# EAGLE design untitled (EAGLE 8.2.2)
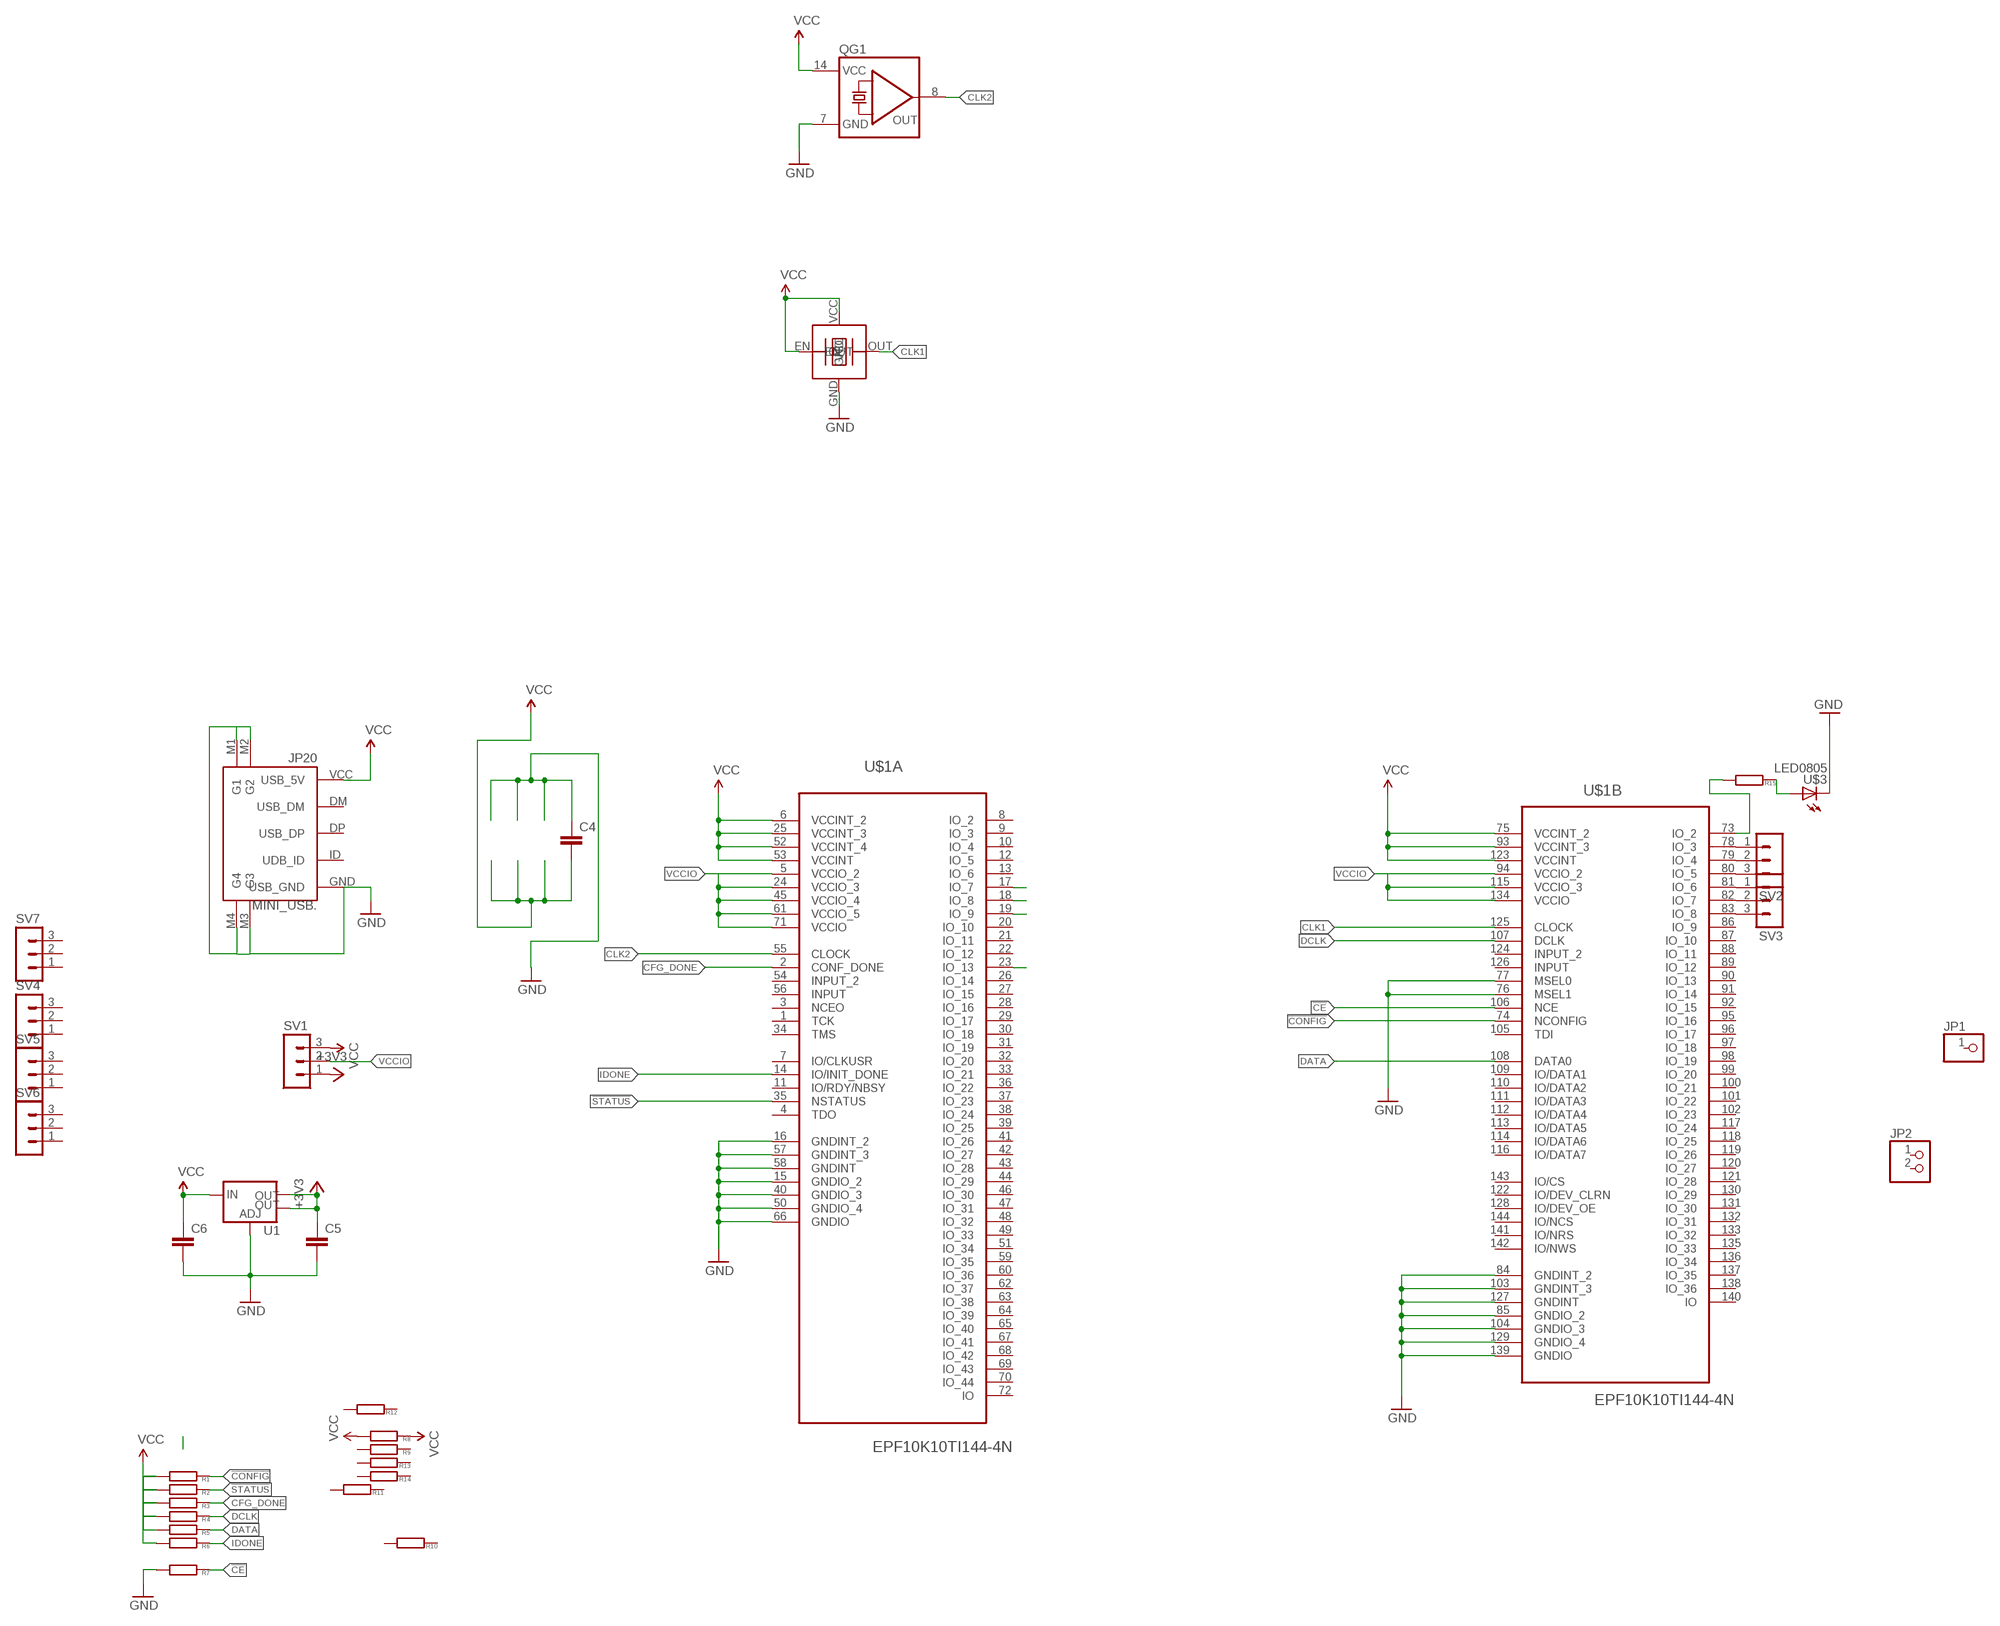
[diagram p0: schematic, sheet 1]

## Parts
C4  CC0805  [C0805]
C5  CC0805  [C0805]
C6  CC0805  [C0805]
JP1  PINHD-1X1  [1X01]
JP2  PINHD-1X2  [1X02]
JP20  MINI_USB.  [32005-201]
QG1  QG5860  [DIL14S]
R1  R0603  [0603]
R2  R0603  [0603]
R3  R0603  [0603]
R4  R0603  [0603]
R5  R0603  [0603]
R6  R0603  [0603]
R7  R0603  [0603]
R8  R0603  [0603]
R9  R0603  [0603]
R10  R0603  [0603]
R11  R0603  [0603]
R12  R0603  [0603]
R13  R0603  [0603]
R14  R0603  [0603]
R15  R0603  [0603]
SV1  MA03-1  [MA03-1]
SV2  MA03-1  [MA03-1]
SV3  MA03-1  [MA03-1]
SV4  MA03-1  [MA03-1]
SV5  MA03-1  [MA03-1]
SV6  MA03-1  [MA03-1]
SV7  MA03-1  [MA03-1]
U1  V_REG_LM1117SOT223  [SOT223]
U$1  EPF10K10TI144-4N  [QFP50P2200X2200X160-144N]
U$2  TXC-BA  [7X5]
U$3  LED0805  [0805-LED]

## Nets
!CE: R7.1 U$1.106(B:NCE)
!CONFIG: R1.1 U$1.74(B:NCONFIG)
!STATUS: R2.1 U$1.35(A:NSTATUS)
+3V3: C5.1 SV1.1 U1.2(OUT) U1.4(OUT)
CFG_DONE: R3.1 U$1.2(A:CONF_DONE)
CLK1: U$1.125(B:CLOCK) U$2.OUT
CLK2: QG1.8(OUT) U$1.55(A:CLOCK)
DATA: R5.1 U$1.108(B:DATA0)
DCLK: R4.1 U$1.107(B:DCLK)
GND: C4.1 C5.2 C6.2 JP20.GND(USB_GND) JP20.M1(G1) JP20.M2(G2) JP20.M3(G3) JP20.M4(G4) QG1.7(GND) R7.2 U1.1(ADJ) U$1.15(A:GNDIO_2) U$1.16(A:GNDINT_2) U$1.40(A:GNDIO_3) U$1.50(A:GNDIO_4) U$1.57(A:GNDINT_3) U$1.58(A:GNDINT) U$1.66(A:GNDIO) U$1.76(B:MSEL1) U$1.77(B:MSEL0) U$1.84(B:GNDINT_2) U$1.85(B:GNDIO_2) U$1.103(B:GNDINT_3) U$1.104(B:GNDIO_3) U$1.127(B:GNDINT) U$1.129(B:GNDIO_4) U$1.139(B:GNDIO) U$2.GND U$3.C
IDONE: R6.1 U$1.14(A:IO/INIT_DONE)
N$1: R11.1
N$3: U$1.17(A:IO_7)
N$4: R11.2
N$7: SV2.1 U$1.78(B:IO_3)
N$8: SV2.2 U$1.79(B:IO_4)
N$9: SV2.3 U$1.80(B:IO_5)
N$10: SV3.1 U$1.81(B:IO_6)
N$11: SV3.2 U$1.82(B:IO_7)
N$12: SV3.3 U$1.83(B:IO_8)
N$13: R15.2 U$1.73(B:IO_2)
N$14: R15.1 U$3.A
N$23: U$1.18(A:IO_8)
N$24: U$1.19(A:IO_9)
N$28: U$1.23(A:IO_13)
VCC: C4.2 C6.1 JP20.VCC(USB_5V) QG1.14(VCC) R1.2 R2.2 R3.2 R4.2 R5.2 R6.2 R8.1 R8.2 SV1.3 U1.3(IN) U$1.6(A:VCCINT_2) U$1.25(A:VCCINT_3) U$1.52(A:VCCINT_4) U$1.53(A:VCCINT) U$1.75(B:VCCINT_2) U$1.93(B:VCCINT_3) U$1.123(B:VCCINT) U$2.EN U$2.VCC
VCCIO: SV1.2 U$1.5(A:VCCIO_2) U$1.24(A:VCCIO_3) U$1.45(A:VCCIO_4) U$1.61(A:VCCIO_5) U$1.71(A:VCCIO) U$1.94(B:VCCIO_2) U$1.115(B:VCCIO_3) U$1.134(B:VCCIO)
Unconnected: JP1.1 JP2.1 JP2.2 JP20.DM(USB_DM) JP20.DP(USB_DP) JP20.ID(UDB_ID) R9.1 R9.2 R10.1 R10.2 R12.1 R12.2 R13.1 R13.2 R14.1 R14.2 SV4.1 SV4.2 SV4.3 SV5.1 SV5.2 SV5.3 SV6.1 SV6.2 SV6.3 SV7.1 SV7.2 SV7.3 U$1.1(A:TCK) U$1.3(A:NCEO) U$1.4(A:TDO) U$1.7(A:IO/CLKUSR) U$1.8(A:IO_2) U$1.9(A:IO_3) U$1.10(A:IO_4) U$1.11(A:IO/RDY/NBSY) U$1.12(A:IO_5) U$1.13(A:IO_6) U$1.20(A:IO_10) U$1.21(A:IO_11) U$1.22(A:IO_12) U$1.26(A:IO_14) U$1.27(A:IO_15) U$1.28(A:IO_16) U$1.29(A:IO_17) U$1.30(A:IO_18) U$1.31(A:IO_19) U$1.32(A:IO_20) U$1.33(A:IO_21) U$1.34(A:TMS) U$1.36(A:IO_22) U$1.37(A:IO_23) U$1.38(A:IO_24) U$1.39(A:IO_25) U$1.41(A:IO_26) U$1.42(A:IO_27) U$1.43(A:IO_28) U$1.44(A:IO_29) U$1.46(A:IO_30) U$1.47(A:IO_31) U$1.48(A:IO_32) U$1.49(A:IO_33) U$1.51(A:IO_34) U$1.54(A:INPUT_2) U$1.56(A:INPUT) U$1.59(A:IO_35) U$1.60(A:IO_36) U$1.62(A:IO_37) U$1.63(A:IO_38) U$1.64(A:IO_39) U$1.65(A:IO_40) U$1.67(A:IO_41) U$1.68(A:IO_42) U$1.69(A:IO_43) U$1.70(A:IO_44) U$1.72(A:IO) U$1.86(B:IO_9) U$1.87(B:IO_10) U$1.88(B:IO_11) U$1.89(B:IO_12) U$1.90(B:IO_13) U$1.91(B:IO_14) U$1.92(B:IO_15) U$1.95(B:IO_16) U$1.96(B:IO_17) U$1.97(B:IO_18) U$1.98(B:IO_19) U$1.99(B:IO_20) U$1.100(B:IO_21) U$1.101(B:IO_22) U$1.102(B:IO_23) U$1.105(B:TDI) U$1.109(B:IO/DATA1) U$1.110(B:IO/DATA2) U$1.111(B:IO/DATA3) U$1.112(B:IO/DATA4) U$1.113(B:IO/DATA5) U$1.114(B:IO/DATA6) U$1.116(B:IO/DATA7) U$1.117(B:IO_24) U$1.118(B:IO_25) U$1.119(B:IO_26) U$1.120(B:IO_27) U$1.121(B:IO_28) U$1.122(B:IO/DEV_CLRN) U$1.124(B:INPUT_2) U$1.126(B:INPUT) U$1.128(B:IO/DEV_OE) U$1.130(B:IO_29) U$1.131(B:IO_30) U$1.132(B:IO_31) U$1.133(B:IO_32) U$1.135(B:IO_33) U$1.136(B:IO_34) U$1.137(B:IO_35) U$1.138(B:IO_36) U$1.140(B:IO) U$1.141(B:IO/NRS) U$1.142(B:IO/NWS) U$1.143(B:IO/CS) U$1.144(B:IO/NCS)

## Library data of the parts
C4-C6 = smalsmd:C: Capacitor
JP1 = pinhead:PINHD-1X1: PIN HEADER
JP2 = pinhead:PINHD-1X2: PIN HEADER
JP20 = connectors:MINI_USB
QG1 = crystal:QG5860: CRYSTAL RESONATOR; OC_FARNELL: unknown; OC_NEWARK: unknown
R1-R15 = smalsmd:R
SV1-SV7 = con-lstb:MA03-1: PIN HEADER; OC_FARNELL: unknown; OC_NEWARK: unknown
U1 = SparkFun-PowerIC:V_REG_LM1117: Voltage Regulator LM1117 Standard adjustable voltage regulator but in SMD form. Spark Fun Electronics SKU : COM-00595; PROD_ID: VREG-08170
U$1 = Altera_By_element14_Batch_1:EPF10K10TI144-4N: Embedded Programmable Logic Device; MPN: EPF10K10TI144-4N; OC_FARNELL: -; OC_NEWARK: 51R8776; PACKAGE: QFP-144; SUPPLIER: Altera
U$2 = txc:TXC-BA**
U$3 = smalsmd:LED

## Board
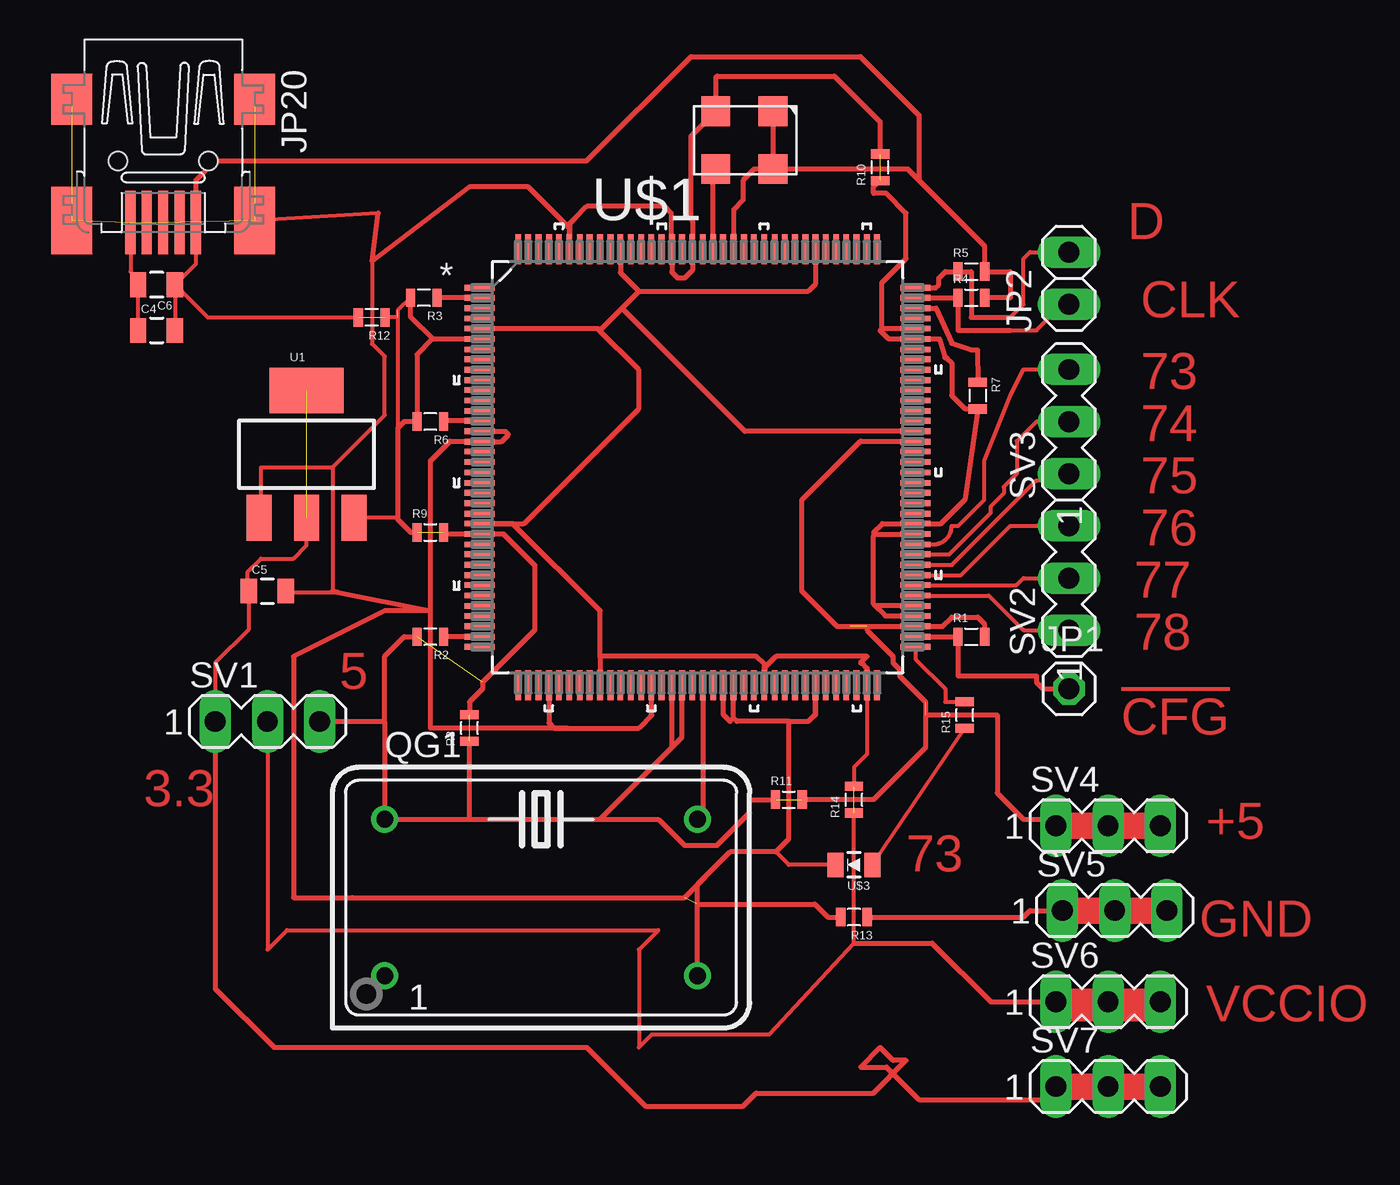
[diagram p1: board, top side]

No outline drawn. Coordinates in mm, seen from the top.
Copper layers (1*16): Top 0.035mm / dielectric 1.5mm / Bottom 0.035mm
Design rules "default": minimum track width 10mil, minimum drill 24mil, track to track 8mil, track to pad 8mil, pad to pad 8mil, via to via 8mil, smd to smd 8mil, copper to edge 40mil, drill to drill 8mil, minimum pad ring 10mil, minimum via ring 8mil, stop-mask expansion 4mil, vias tented up to drill 0mil, thermal gap 10mil

### Footprints (pad centres in the part's own frame; a part is rotated, then mirrored left to right if it is on the bottom)
C0805 = smd 0.8 x 1.2: 1 -0.9,0; 2 0.9,0
1X01 = drill 1.016 octagon: 1 0,0
1X02 = drill 1.016 long: 1 -1.27,0; 2 1.27,0
32005-201 = smd 3.1 x 0.5: DM 3,0.8; DP 3,0; GND 3,-1.6; ID 3,-0.8; VCC 3,1.6 | smd 2.5 x 2: M1 -3,-4.45; M2 -3,4.45 | smd 3.3 x 2: M3 2.9,4.45; M4 2.9,-4.45 | hole 0.9: 0,2.2; 0,-2.2
DIL14S = drill 0.813: 1 -7.62,-3.81; 7 7.62,-3.81; 8 7.62,3.81; 14 -7.62,3.81
0603 = smd 0.45 x 0.9: 1 -0.65,0; 2 0.65,0
MA03-1 = drill 1.016 long: 1 -2.54,0; 2 0,0; 3 2.54,0
SOT223 = smd 1.219 x 2.235: 1 -2.311,-3.099; 2 0,-3.099; 3 2.311,-3.099 | smd 3.6 x 2.2: 4 0,3.099
QFP50P2200X2200X160-144N = smd 1.473 x 0.279: 1 -10.617,8.738; 2 -10.617,8.255; 3 -10.617,7.747; 4 -10.617,7.239; 5 -10.617,6.756; 6 -10.617,6.248; 7 -10.617,5.74; 8 -10.617,5.258; 9 -10.617,4.75; 10 -10.617,4.242; 11 -10.617,3.759; 12 -10.617,3.251; 13 -10.617,2.743; 14 -10.617,2.261; 15 -10.617,1.753; 16 -10.617,1.245; 17 -10.617,0.762; 18 -10.617,0.254; 19 -10.617,-0.254; 20 -10.617,-0.762; 21 -10.617,-1.245; 22 -10.617,-1.753; 23 -10.617,-2.261; 24 -10.617,-2.743; 25 -10.617,-3.251; 26 -10.617,-3.759; 27 -10.617,-4.242; 28 -10.617,-4.75; 29 -10.617,-5.258; 30 -10.617,-5.74; 31 -10.617,-6.248; 32 -10.617,-6.756; 33 -10.617,-7.239; 34 -10.617,-7.747; 35 -10.617,-8.255; 36 -10.617,-8.738; 73 10.617,-8.738; 74 10.617,-8.255; 75 10.617,-7.747; 76 10.617,-7.239; 77 10.617,-6.756; 78 10.617,-6.248; 79 10.617,-5.74; 80 10.617,-5.258; 81 10.617,-4.75; 82 10.617,-4.242; 83 10.617,-3.759; 84 10.617,-3.251; 85 10.617,-2.743; 86 10.617,-2.261; 87 10.617,-1.753; 88 10.617,-1.245; 89 10.617,-0.762; 90 10.617,-0.254; 91 10.617,0.254; 92 10.617,0.762; 93 10.617,1.245; 94 10.617,1.753; 95 10.617,2.261; 96 10.617,2.743; 97 10.617,3.251; 98 10.617,3.759; 99 10.617,4.242; 100 10.617,4.75; 101 10.617,5.258; 102 10.617,5.74; 103 10.617,6.248; 104 10.617,6.756; 105 10.617,7.239; 106 10.617,7.747; 107 10.617,8.255; 108 10.617,8.738 | smd 0.279 x 1.473: 37 -8.738,-10.617; 38 -8.255,-10.617; 39 -7.747,-10.617; 40 -7.239,-10.617; 41 -6.756,-10.617; 42 -6.248,-10.617; 43 -5.74,-10.617; 44 -5.258,-10.617; 45 -4.75,-10.617; 46 -4.242,-10.617; 47 -3.759,-10.617; 48 -3.251,-10.617; 49 -2.743,-10.617; 50 -2.261,-10.617; 51 -1.753,-10.617; 52 -1.245,-10.617; 53 -0.762,-10.617; 54 -0.254,-10.617; 55 0.254,-10.617; 56 0.762,-10.617; 57 1.245,-10.617; 58 1.753,-10.617; 59 2.261,-10.617; 60 2.743,-10.617; 61 3.251,-10.617; 62 3.759,-10.617; 63 4.242,-10.617; 64 4.75,-10.617; 65 5.258,-10.617; 66 5.74,-10.617; 67 6.248,-10.617; 68 6.756,-10.617; 69 7.239,-10.617; 70 7.747,-10.617; 71 8.255,-10.617; 72 8.738,-10.617; 109 8.738,10.617; 110 8.255,10.617; 111 7.747,10.617; 112 7.239,10.617; 113 6.756,10.617; 114 6.248,10.617; 115 5.74,10.617; 116 5.258,10.617; 117 4.75,10.617; 118 4.242,10.617; 119 3.759,10.617; 120 3.251,10.617; 121 2.743,10.617; 122 2.261,10.617; 123 1.753,10.617; 124 1.245,10.617; 125 0.762,10.617; 126 0.254,10.617; 127 -0.254,10.617; 128 -0.762,10.617; 129 -1.245,10.617; 130 -1.753,10.617; 131 -2.261,10.617; 132 -2.743,10.617; 133 -3.251,10.617; 134 -3.759,10.617; 135 -4.242,10.617; 136 -4.75,10.617; 137 -5.258,10.617; 138 -5.74,10.617; 139 -6.248,10.617; 140 -6.756,10.617; 141 -7.239,10.617; 142 -7.747,10.617; 143 -8.255,10.617; 144 -8.738,10.617
7X5 = smd 1.4 x 1.45: EN -1.448,-1.465; GND 1.333,-1.465; OUT 1.333,1.345; VCC -1.448,1.345
0805-LED = smd 0.8 x 1.2: A -0.9,0; C 0.9,0

### Placement (x,y rotation side)
C4  21.27,37.15 0 top
C5  26.67,24.45 0 top
C6  21.27,39.37 180 top
JP1  65.72,19.68 0 top
JP2  65.72,39.69 90 top
JP20  21.59,45.4 270 top
QG1  40.01,9.53 0 top
R1  60.96,22.23 0 top
R2  34.61,22.23 180 top
R3  34.29,38.73 180 top
R4  60.96,38.73 0 top
R5  60.96,40.01 0 top
R6  34.61,32.7 180 top
R7  61.28,33.97 270 top
R8  36.51,17.78 90 top
R9  34.61,27.3 0 top
R10  56.52,45.09 90 top
R11  52.07,14.29 0 top
R12  31.75,37.78 180 top
R13  55.24,8.57 180 top
R14  55.24,14.29 90 top
R15  60.64,18.41 90 top
SV1  26.67,18.1 0 top
SV2  65.72,25.08 90 top
SV3  65.72,32.7 90 top
SV4  67.63,13.02 0 top
SV5  67.94,8.89 0 top
SV6  67.63,4.45 0 top
SV7  67.63,0.32 0 top
U1  28.57,31.11 0 top
U$1  47.62,30.48 0 top
U$2  TXC-BA*  [7X5]  49.85,46.35 180 top
U$3  55.24,11.11 180 top

### Tracks (layer width: path | path; a pad name or v marks a point on that pad's centre or on a via)
!CE
  Top 0.254: U$1.106 59.24,38.23 60.01,36.51 60.96,36.2 61.26,36.2 R7.1
!CONFIG
  Top 0.254: U$1.74 R1.1 60.31,20.34 60.33,20.32 64.14,20.32 64.14,20 64.45,19.68 65.72,19.68
!STATUS
  Top 0.254: U$1.35 R2.1
+3V3  (1 unrouted)
  Top 0.203: U1.2 28.57,26.67 27.94,26.04 26.35,26.04 25.72,25.4 25.72,24.5 C5.1 25.77,22.59 24.13,20.95 SV1.1
  Top 0.254: SV1.1 24.13,5.08 26.99,2.22 42.23,2.22 45.09,-0.64 49.85,-0.64 50.48,0 56.2,0 57.78,1.59 57.15,1.59 56.52,2.22 55.56,1.27 56.83,1.27 58.42,-0.32 64.77,-0.32 65.09,0 65.09,0.32
CFG_DONE
  Top 0.254: U$1.2 R3.1
CLK1
  Top 0.254: U$1.125 48.39,44.88 U$2.OUT
CLK2
  Top 0.254: U$1.55 47.88,13.59 QG1.8
DATA
  Top 0.203: 62.55,37.78 62.87,37.78 63.5,38.42 63.5,40.64 63.82,40.96 65.72,40.96
  Top 0.254: U$1.108 59.22,39.22 59.37,39.37 59.37,39.69 59.69,40.01 R5.1 60.96,40.01 60.96,37.78 62.87,37.78
DCLK
  Top 0.203: 62.87,37.15 64.14,37.15 65.41,38.42
  Top 0.254: U$1.107 R4.1 60.31,37.16 60.33,37.15 62.87,37.15
GND  (6 unrouted)
  Top 0.203: JP20.GND 20,42.39 20,40.01 20.37,39.63 C6.2 C4.1 | 29.84,30.48 29.84,24.45 | 29.84,30.48 32.38,33.02 32.38,35.88 31.77,36.49 31.77,40.52 | 32.07,42.86 26.39,42.5 JP20.M3 | U1.1 26.35,28.11 26.35,30.48 29.84,30.48 | C5.2 27.62,24.4 30.08,24.4 | U$3.C 52.07,11.11 51.44,11.75
  Top 0.254: 41.65,42.6 42.23,43.18 46.04,43.18 46.35,42.86 46.35,41.12 U$1.129 46.38,39.98 46.67,39.69 46.99,39.69 47.37,40.07 U$1.127 47.37,42.48 47.31,42.55 47.31,46.61 U$2.GND 48.52,49.47 48.58,49.53 54.29,49.53 56.52,47.31 56.52,45.72 | 41.65,42.6 41.59,42.55 | 41.65,42.6 41.38,42.33 U$1.139 41.38,42.13 39.37,44.13 36.51,44.13 31.77,40.52 32.07,42.86 | U$1.15 38.25,32.23 38.42,32.07 38.08,31.73 U$1.16 36.98,31.75 35.56,31.75 34.61,30.8 34.61,23.5 | QG1.7 47.62,10.16 49.04,11.57 | 49.04,11.57 49.21,11.75 51.44,11.75 52.07,12.38 52.07,18.06 52.11,18.1 | 49.38,18.26 U$1.58 | 49.38,18.26 49.21,18.1 48.87,18.44 U$1.57 | 52.11,18.1 53.02,18.1 53.37,18.44 U$1.66 53.37,18.39 | 52.11,18.1 49.54,18.1 49.38,18.26 | U$1.40 40.39,18.03 40.64,17.78 41.27,17.78 | 41.27,17.78 44.77,17.78 45.4,18.41 45.36,18.45 U$1.50 | 41.27,17.78 34.61,17.78 34.61,20.95 34.61,23.5 | 34.61,23.5 32.38,23.5 27.94,21.27 27.94,9.53 30.8,9.53 46.99,9.53 49.04,11.57 | U$1.104 56.6,37.24 | 56.6,37.24 56.52,37.15 56.93,36.73 U$1.103 59.41,36.73 59.67,35.84 59.68,35.83 59.68,35.82 59.78,35.79 60.01,35.56 60.01,33.97 60.64,33.34 61.09,33.34 61.26,33.17 | 56.27,27.23 U$1.84 | 56.27,27.23 56.2,27.3 56.63,27.74 U$1.85 59.49,27.74 60.64,28.89 61.26,33.17 | U$1.76 56.77,23.24 56.2,23.81 | U$1.77 56.29,23.72 56.2,23.81 | 56.2,23.81 56.2,27.15 56.27,27.23 | 34.61,23.5 30.08,24.4 29.84,24.45 | 61.26,33.17 R7.2 | 56.6,37.24 56.6,39.46 57.78,40.64 57.78,42.86 56.83,43.81 56.2,43.81 56.2,44.13 56.52,44.45 | 47.62,9.21 53.34,9.21 53.98,8.57 54.61,8.57
IDONE
  Top 0.254: U$1.14 35.3,32.74 R6.1
N$7
  Top 0.203: U$1.78 61.81,24.23 63.5,22.54 SV2.1
N$8
  Top 0.203: U$1.79 63.16,24.74 63.5,25.08 SV2.2
N$9
  Top 0.203: SV2.3 62.87,27.62 60.47,25.22 U$1.80
N$10
  Top 0.203: U$1.81 60.02,25.73 64.14,29.84 65.41,29.84 SV3.1
N$11
  Top 0.203: SV3.2 64.14,32.7 63.18,31.75 63.18,30.16 62.55,29.53 62.55,29.21 61.91,28.57 61.91,28.26 59.89,26.24 U$1.82
N$12
  Top 0.203: U$1.83 59.11,26.72 arc90 60.01,27.62 60.33,27.62 61.59,28.89 61.59,30.8 62.87,33.97 63.5,35.24 SV3.3
N$13
  Top 0.203: U$1.73 58.24,21.13 59.69,19.68 59.69,19.05 60.63,19.05 R15.2
N$14
  Top 0.203: U$3.A R15.1
N$15
  Top 0.254: 55.88,8.57 63.5,8.57 63.82,8.89 65.41,8.89
VCC  (10 unrouted)
  Top 0.203: C6.1 23.19,40.39 JP20.VCC | C6.1 C4.2 | R3.2 33.02,38.12 33.02,27.94 32.94,28.02 U1.3 | 33.02,37.78 32.38,37.78 | C6.1 23.76,37.78 31.11,37.78
  Top 0.254: U$2.VCC 50.41,45.01 49.85,44.45 49.85,43.5 49.38,43.03 U$1.123 | U$2.EN U$2.VCC | 34.72,36.73 U$1.6 | 34.72,36.73 34.71,36.73 33.66,37.78 33.66,38.72 R3.2 | 34.72,36.73 33.96,35.96 R6.2 33.34,32.7 33.02,32.38 33.02,27.94 33.66,27.3 33.97,27.3 | 42.86,13.34 QG1.14 32.38,18.06 | 46.34,16.82 42.86,13.34 | 46.34,16.82 46.35,16.83 | 46.38,16.85 U$1.52 | 46.38,16.85 46.34,16.82 | U$1.53 46.86,17.34 46.38,16.85 | 55.05,22.73 U$1.75 | 32.38,18.06 32.38,21.27 33.34,22.23 R2.2 | U$2.VCC 57.86,45.01 58.48,44.39 | 58.48,44.39 61.59,41.27 61.59,40.02 R5.2 62.87,40.01 62.87,38.73 R4.2 | 54.42,22.73 U$1.75 | 54.42,22.73 52.7,24.45 52.7,28.89 55.39,31.57 | 55.39,31.57 55.56,31.75 | U$1.93 55.54,31.73 55.39,31.57 | 36.51,18.41 36.51,19.05 37.15,19.68 37.15,20 39.69,22.54 39.69,25.72 38.18,27.23 U$1.25 35.32,27.23 35.24,27.3 | 36.51,13.34 36.51,17.14 | 54.29,22.86 54.42,22.73 | U$1.75 59.56,22.73 60.01,23.18 61.28,23.18 61.59,22.86 61.59,22.24 R1.2 | 55.88,22.73 55.88,22.54 57.15,21.27 57.15,20.95 57.47,20.64 57.47,20.32 58.74,19.05 58.74,16.83 56.2,14.29 52.7,14.29 | 42.86,13.34 45.72,13.34 46.99,12.06 48.58,12.06 50.16,13.65 50.16,14.29 51.44,14.29 | SV1.3 32.35,18.1 32.38,18.06 | JP20.VCC 23.19,44.46 24.13,45.4 42.23,45.4 47.31,50.48 55.56,50.48 58.42,47.62 58.42,44.45 58.48,44.39 | 58.74,18.41 62.23,18.41 62.23,14.61 63.5,13.34 64.77,13.34
VCCIO  (1 unrouted)
  Top 0.203: SV1.2 26.67,6.99 27.62,7.94 45.72,7.94 44.77,6.99 44.77,2.22 45.4,2.86 51.12,2.86 55.24,7.3 55.24,13.65 | U$1.71 55.88,16.51 55.24,15.88 55.24,14.92
  Top 0.254: U$1.115 53.37,39.4 53.02,39.05 44.77,39.05 | U$1.134 43.87,39.95 44.77,39.05 | 42.76,37.24 42.95,37.24 43.94,38.23 | 42.76,37.24 U$1.5 | 43.94,38.23 44.77,39.05 | U$1.71 55.88,20.7 55.65,20.93 55.59,20.93 55.56,20.95 55.88,21.27 51.45,21.27 50.91,20.74 50.91,20.64 50.88,20.6 U$1.61 50.88,20.88 50.48,21.27 42.89,21.27 42.88,21.26 | 42.88,21.26 42.88,23.48 38.62,27.74 U$1.24 39.17,27.74 44.77,33.34 44.77,35.22 42.76,37.24 | 42.88,21.26 U$1.45 | U$1.94 49.93,32.23 43.94,38.23 | 55.24,7.3 59.05,7.3 61.91,4.45 65.41,4.45
(copper drawn outside any net)
  shapes: Top area x4

### Text on the board
Top: D | CLK | 73 | 74 | 75 | 76 | 77 | 78 | 5 | !CFG | 3.3 | +5 | 73 | GND | VCCIO